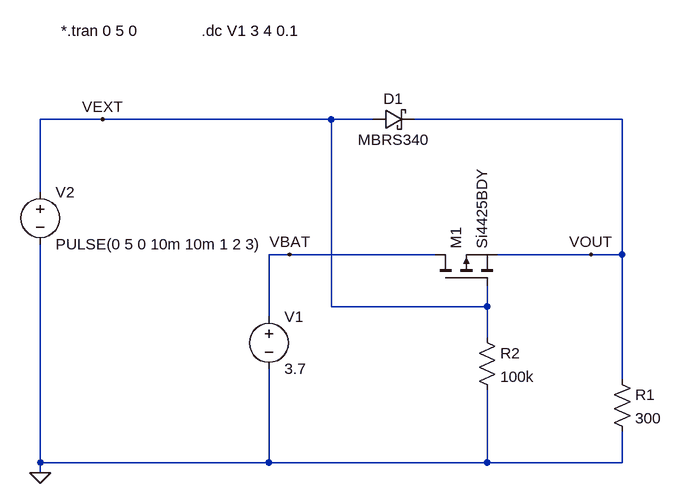
[diagram p0: schematic power_mux_pmos.asc]
power_mux_pmos.asc, the LTspice schematic file:
Version 4
SHEET 1 880 680
WIRE -112 96 -208 96
WIRE 240 96 -112 96
WIRE 304 96 240 96
WIRE 688 96 368 96
WIRE -208 208 -208 96
WIRE 176 304 144 304
WIRE 400 304 176 304
WIRE 640 304 496 304
WIRE 688 304 688 96
WIRE 688 304 640 304
WIRE 240 384 240 96
WIRE 480 384 480 352
WIRE 480 384 240 384
WIRE 144 400 144 304
WIRE 480 432 480 384
WIRE 688 496 688 304
WIRE -208 624 -208 288
WIRE 144 624 144 480
WIRE 144 624 -208 624
WIRE 480 624 480 512
WIRE 480 624 144 624
WIRE 688 624 688 576
WIRE 688 624 480 624
WIRE -208 640 -208 624
FLAG -112 96 VEXT
FLAG 640 304 VOUT
FLAG 176 304 VBAT
FLAG -208 640 0
SYMBOL pmos 400 352 R270
SYMATTR InstName M1
SYMATTR Value Si4425BDY
SYMBOL res 672 480 R0
SYMATTR InstName R1
SYMATTR Value 300
SYMBOL voltage 144 384 R0
SYMATTR InstName V1
SYMATTR Value 3.7
SYMATTR SpiceLine Rser=10m
SYMBOL voltage -208 192 R0
SYMATTR InstName V2
SYMATTR Value PULSE(0 5 0 10m 10m 1 2 3)
SYMBOL schottky 304 112 R270
WINDOW 0 32 32 VTop 2
WINDOW 3 0 32 VBottom 2
SYMATTR InstName D1
SYMATTR Value MBRS340
SYMBOL res 464 416 R0
SYMATTR InstName R2
SYMATTR Value 100k
TEXT -176 -40 Left 2 !*.tran 0 5 0
TEXT 40 -40 Left 2 !.dc V1 3 4 0.1

The netlist it stands for:
* power_mux_pmos.asc
M1 VBAT VEXT VOUT VOUT Si4425BDY
R1 VOUT 0 300
V1 VBAT 0 3.7 Rser=10m
V2 VEXT 0 PULSE(0 5 0 10m 10m 1 2 3)
D1 VEXT VOUT MBRS340
R2 VEXT 0 100k
.model D D
.lib standard.dio
.model NMOS NMOS
.model PMOS PMOS
.lib standard.mos
*.tran 0 5 0
.dc V1 3 4 0.1
.backanno
.end